# Altium schematic sheet LED_driver_sch.SchDoc
size A
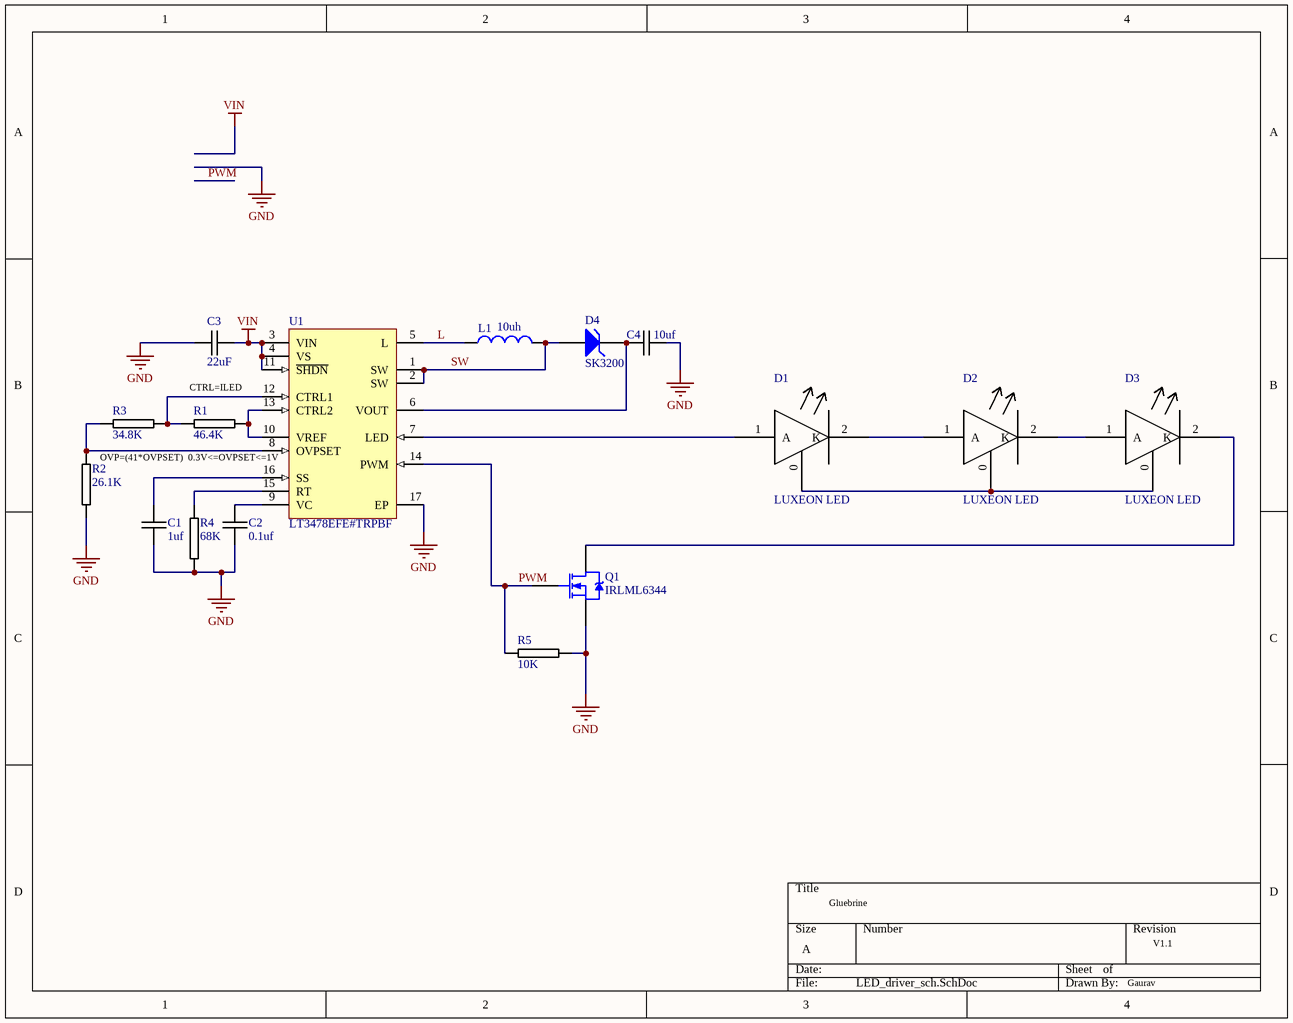
[diagram p0: LED_driver_sch.SchDoc]

## Parts
C1  1uf  [0805C-TBD]
C2  0.1uf  [0805C-TBD]
C3  22uF  [1210C-GENERIC]
C4  10uf  [1210C-GENERIC]
D1  LUXEON LED  [LUXEON]
D2  LUXEON LED  [LUXEON]
D3  LUXEON LED  [LUXEON]
D4  SK3200  [SK3200]
L1  10uh  [SRR1280A]
Q1  IRLML6344  [SOT-23_N]
R1  46.4K  [0805R-TBD]
R2  26.1K  [0805R-TBD]
R3  34.8K  [0805R-TBD]
R4  68K  [0805R-TBD]
R5  10K  [0603R-10K]
U1  LT3478EFE#TRPBF  [LT-FE-16-EPV-BC_N]

## Nets
GND: C1.1 C2.1 C3.2 C4.2 Q1.2(S) R2.2 R4.2 R5.2 U1.17(EP)
VIN: C3.1 U1.3(VIN) U1.4(VS) U1.11(~{SHDN})
L: L1.1 U1.5(L)
PWM: Q1.1(G) R5.1 U1.14(PWM)
SW: D4.1(A) L1.2 U1.1(SW) U1.2(SW)
NetC1_2: C1.2 U1.16(SS)
NetC2_2: C2.2 U1.9(VC)
NetC4_1: C4.1 D4.2(K) U1.6(VOUT)
NetD1_0: D1.0(TH) D2.0(TH) D3.0(TH)
NetD1_1: D1.1(A) U1.7(LED)
NetD1_2: D1.2(K) D2.1(A)
NetD2_2: D2.2(K) D3.1(A)
NetD3_2: D3.2(K) Q1.3(D)
NetR1_1: R1.1 R3.2 U1.12(CTRL1)
NetR1_2: R1.2 U1.10(VREF) U1.13(CTRL2)
NetR2_1: R2.1 R3.1 U1.8(OVPSET)
NetR4_1: R4.1 U1.15(RT)

## Notes on the sheet
- CTRL=ILED
- (near R2) OVP=(41*OVPSET)  0.3V<=OVPSET<=1V
- Gluebrine
- V1.1
- Gaurav

## Library data of the parts
C1 C2 = 0805C-TBD: CAPACITOR 0805 CERAMIC VALUE TO BE DETERMINED
C3 C4 = 1210C-22UF-6V3-X5R-PAN: GENERIC CAPACITOR NON POLARISED 1210; Manufacturer: Panasonic - ECG; Manufacturer Part Number: ECJ-4YB0J226M; Reel: C25; Supplier 1: Digi-Key; Supplier Part Number 1: PCC2179TR-ND
D1-D3 = LMX-PWC2
L1 = inductor_smd
Q1 = IRLML2402: HEXFET Power MOSFET; Published: 8-Jun-2000; LatestRevisionDate: 20-Nov-2009; LatestRevisionNote: IPC-7351 Footprint Added.; DatasheetVersion: Aug-1997; PackageReference: SOT-23; Publisher: Altium Limited; PackageDescription: 3-Pin SOT-23 Package 0.95 mm Pitch, 2.3 mm Lead Span; ComponentLink1Description: Manufacturer Link; ComponentLink1URL: http://www.irf.com/; ComponentLink2Description: Datasheet; ComponentLink2URL: http://www.irf.com/product-info/datasheets/data/irlml2402.pdf
R1-R4 = 0805R-TBD: RESISTOR 0805 VALUE TO BE DETERMINED
R5 = 0603R-10K: GENERIC RESISTOR 0603; Manufacturer: Stackpole Electronics Inc; Manufacturer Part Number: RMCF 1/16 10K 1% R; Tolerance: ±1%; Power (Watts): 0.1W, 1/10W; Temperature Coefficient: ±100ppm/°C; Resistance In Ohms: 10.0K; Reel: R21; Category: Resistors; Supplier Part Number: RMCF1/1610KFRDKR-ND; Lead Style: Surface Mount (SMD - SMT); RoHS: RoHS Compliant; Packaging: Digi-Reel®; Case: 0603 (1608 metric); Composition: Thick Film; Supplier: Digi-Key; Supplier 1: Digi-Key; Supplier Part Number 1: RMCF0603FT10K0DKR-ND
U1 = LT3478EFE#TRPBF: 4.5 A Monolithic LED Driver with True Color PWM Dimming, 2.8 to 36 V Vin, 42 V Vout MAX, 16-pin SOP (FE-16-EPV-BC), -40 to 125 degC, Pb-Free, Tape and Reel; Manufacturer: Linear Technology; Topology: Boost, Buck-Boost, Buck, LED Driver; Vin Min(V): 2.8; PackageVersion: Rev. J, 11/2012; PackageReference: FE-16; PackageDescription: 16-Pin Plastic TSSOP, Body 5 x 4.4 mm, Pitch 0.65 mm; Supplier 1: Digi-Key; Supplier Part Number 1: LT3478EFE#TRPBF-ND; Packing: Tape and Reel; RoHS: TRUE; Mounting Technology: Surface Mount; PartNumber: LT3478EFE#TRPBF; ComponentLink1Description: Manufacturer URL; ComponentLink1URL: http://www.linear.com/; ComponentLink2Description: Datasheet; ComponentLink2URL: http://cds.linear.com/docs/en/datasheet/34781f.pdf; ComponentLink3Description: Package Specification; ComponentLink3URL: http://cds.linear.com/docs/en/packaging/05081663__J_FE16(BC).pdf